# Altium schematic sheet SH2 - 24V BUCK-BOOST CONVERTER.SchDoc: 24V Buck-Boost Converter
size B; CheckedBy: Lance Bantoto; Engineer: Cindy Li; Organization: UW Robotics; Address1: 200 University Avenue; Address2: Waterloo; Address3: Ontario; Address4: Canada N2L 3G6; DocumentNumber: 2; Revision: 2; SheetNumber: 2; SheetTotal: 10
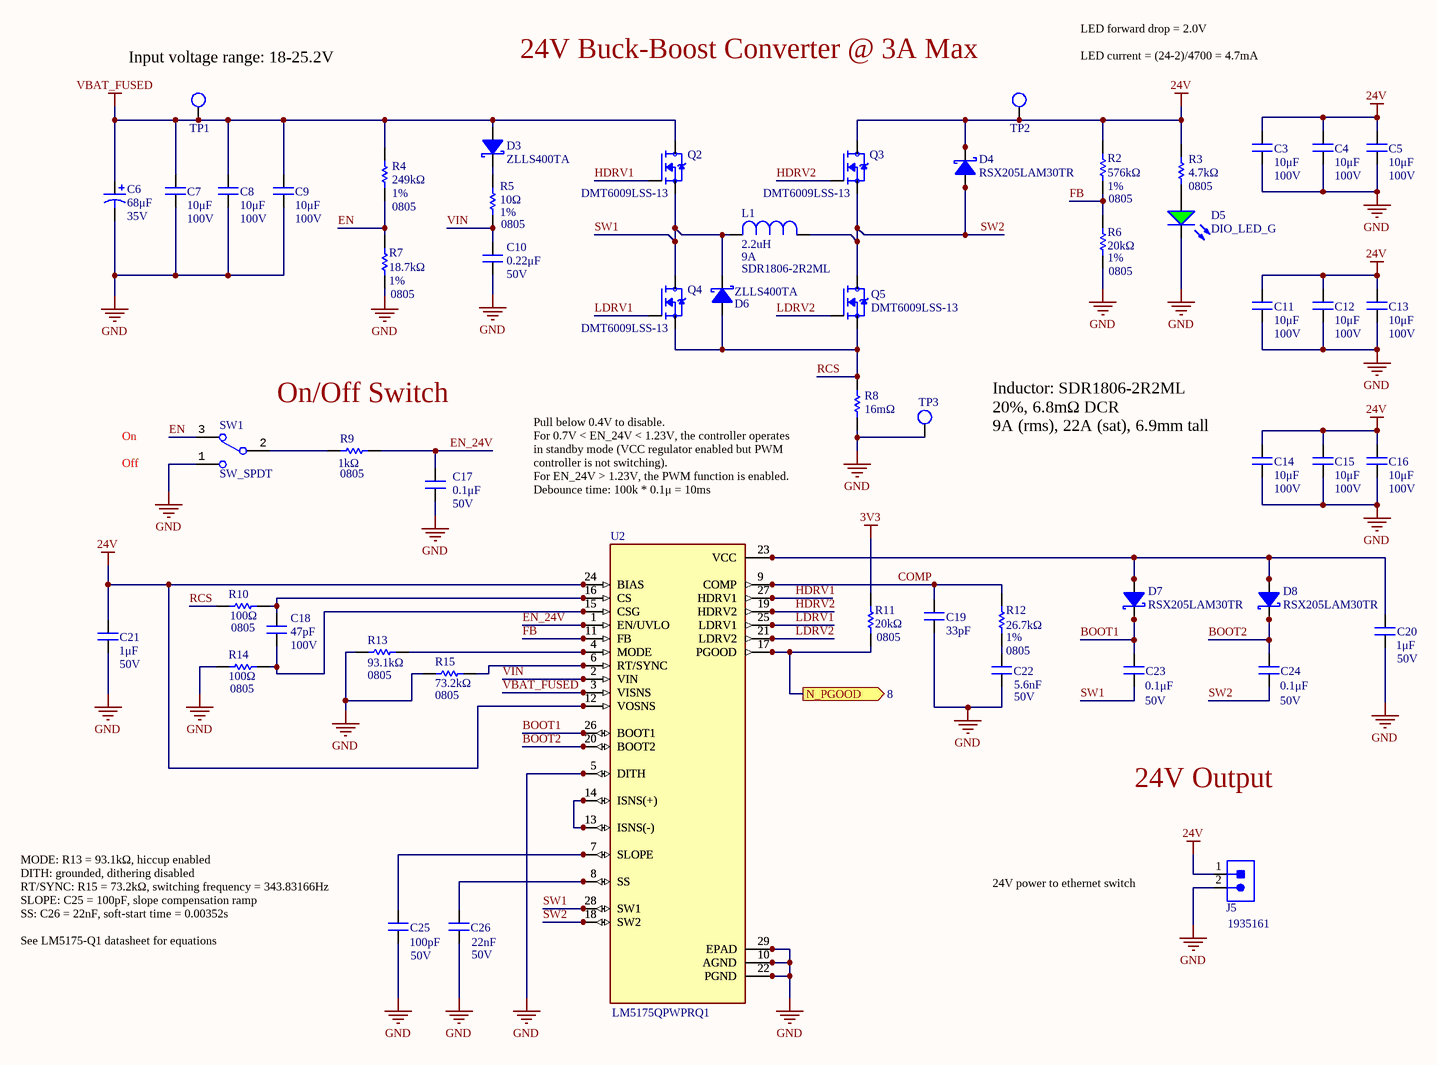
[diagram p0: SH2 - 24V BUCK-BOOST CONVERTER.SchDoc]

## Parts
C3  value 10μF  Voltage Rating: 100V  [CAP1210]  (hidden comment: CAP_10uF_100V_1210)
C4  value 10μF  Voltage Rating: 100V  [CAP1210]  (hidden comment: CAP_10uF_100V_1210)
C5  value 10μF  Voltage Rating: 100V  [CAP1210]  (hidden comment: CAP_10uF_100V_1210)
C6  value 68μF  Voltage Rating: 35V  [RADIAL_NICHION_1V]  (hidden comment: CAP_68uF_35V_ALUM)
C7  value 10μF  Voltage Rating: 100V  [CAP1210]  (hidden comment: CAP_10uF_100V_1210)
C8  value 10μF  Voltage Rating: 100V  [CAP1210]  (hidden comment: CAP_10uF_100V_1210)
C9  value 10μF  Voltage Rating: 100V  [CAP1210]  (hidden comment: CAP_10uF_100V_1210)
C10  value 0.22μF  Voltage Rating: 50V  [CAP2012]  (hidden comment: CAP_0.22uF_50V_0805)
C11  value 10μF  Voltage Rating: 100V  [CAP1210]  (hidden comment: CAP_10uF_100V_1210)
C12  value 10μF  Voltage Rating: 100V  [CAP1210]  (hidden comment: CAP_10uF_100V_1210)
C13  value 10μF  Voltage Rating: 100V  [CAP1210]  (hidden comment: CAP_10uF_100V_1210)
C14  value 10μF  Voltage Rating: 100V  [CAP1210]  (hidden comment: CAP_10uF_100V_1210)
C15  value 10μF  Voltage Rating: 100V  [CAP1210]  (hidden comment: CAP_10uF_100V_1210)
C16  value 10μF  Voltage Rating: 100V  [CAP1210]  (hidden comment: CAP_10uF_100V_1210)
C17  value 0.1μF  Voltage Rating: 50V  [CAP2012]  (hidden comment: CAP_0.1uF_50V_0805)
C18  Voltage Rating: 100V  Capacitance: 47pF  [CAP2012]  (hidden comment: CAP_47pF_100V_0805)
C19  value 33pF  [CAP2012]  (hidden comment: CAP_33pF_50V_0805)
C20  value 1μF  Voltage Rating: 50V  [CAP2012]  (hidden comment: CAP_1uF_50V_0805)
C21  value 1μF  Voltage Rating: 50V  [CAP2012]  (hidden comment: CAP_1uF_50V_0805)
C22  Capacitance: 5.6nF  Voltage Rating: 50V  [CAP2012]  (hidden comment: CAP_5600pF_50V_0805)
C23  value 0.1μF  Voltage Rating: 50V  [CAP2012]  (hidden comment: CAP_0.1uF_50V_0805)
C24  value 0.1μF  Voltage Rating: 50V  [CAP2012]  (hidden comment: CAP_0.1uF_50V_0805)
C25  value 100pF  Voltage Rating: 50V  [CAP2012]  (hidden comment: CAP_100pF_50V_0805)
C26  value 22nF  Voltage Rating: 50V  [CAP2012]  (hidden comment: CAP_0.022uF_50V_0805)
D3  Manufacturer Part Number 1: ZLLS400TA  [SOD-323]  (hidden comment: DIO_SCHOTTKY_40V_520mA)
D4  Manufacturer Part Number 1: RSX205LAM30TR  [SOD-128]  (hidden comment: DIO_SCHOTTKY_30V_2A)
D5  DIO_LED_G  [LED_0805_GREEN]
D6  Manufacturer Part Number 1: ZLLS400TA  [SOD-323]  (hidden comment: DIO_SCHOTTKY_40V_520mA)
D7  Manufacturer Part Number 1: RSX205LAM30TR  [SOD-128]  (hidden comment: DIO_SCHOTTKY_30V_2A)
D8  Manufacturer Part Number 1: RSX205LAM30TR  [SOD-128]  (hidden comment: DIO_SCHOTTKY_30V_2A)
J5  CON_2M_TERM  [1935161]  (value not drawn)
L1  Current Rating: 9A  Manufacturer Part Number 1: SDR1806-2R2ML  Inductance: 2.2uH  [IND_BOURNS_SDR1806]  (hidden comment: IND_2.2uH_9A)
Q2  Manufacturer Part Number 1: DMT6009LSS-13  [TRANS_DMP2002UPS-13]  (hidden comment: NMOS_60V_10.8A)
Q3  Manufacturer Part Number 1: DMT6009LSS-13  [TRANS_DMP2002UPS-13]  (hidden comment: NMOS_60V_10.8A)
Q4  Manufacturer Part Number 1: DMT6009LSS-13  [TRANS_DMP2002UPS-13]  (hidden comment: NMOS_60V_10.8A)
Q5  Manufacturer Part Number 1: DMT6009LSS-13  [TRANS_DMP2002UPS-13]  (hidden comment: NMOS_60V_10.8A)
R2  value 576kΩ  Tolerance: 1%  Package/Footprint: 0805  [RESC0805]  (hidden comment: RES_576kΩ_0805_1%)
R3  value 4.7kΩ  Package/Footprint: 0805  [RESC0805]  (hidden comment: RES_4.7kΩ_0805_5%)
R4  value 249kΩ  Tolerance: 1%  Package/Footprint: 0805  [RESC0805]  (hidden comment: RES_249kΩ_0805_1%)
R5  value 10Ω  Tolerance: 1%  Package/Footprint: 0805  [RESC0805]  (hidden comment: RES_10Ω_0805_1%)
R6  value 20kΩ  Tolerance: 1%  Package/Footprint: 0805  [RESC0805]  (hidden comment: RES_20kΩ_0805_1%)
R7  value 18.7kΩ  Tolerance: 1%  Package/Footprint: 0805  [RESC0805]  (hidden comment: RES_18.7kΩ_0805_1%)
R8  value 16mΩ  [RESC1632X60N]  (hidden comment: RES_16mΩ_1206_1%)
R9  Resistance: 1kΩ  Package/Footprint: 0805  [RESC0805]  (hidden comment: RES_1kΩ_0805_1%)
R10  value 100Ω  Package/Footprint: 0805  [RESC0805]  (hidden comment: RES_100Ω_0805_1%)
R11  value 20kΩ  Package/Footprint: 0805  [RESC0805]  (hidden comment: RES_20kΩ_0805_1%)
R12  value 26.7kΩ  Tolerance: 1%  Package/Footprint: 0805  [RESC0805]  (hidden comment: RES_26.7kΩ_0805_1%)
R13  value 93.1kΩ  Package/Footprint: 0805  [RESC0805]  (hidden comment: RES_93.1kΩ_0805_1%)
R14  value 100Ω  Package/Footprint: 0805  [RESC0805]  (hidden comment: RES_100Ω_0805_1%)
R15  value 73.2kΩ  Package/Footprint: 0805  [RESC0805]  (hidden comment: RES_73.2kΩ_0805_1%)
SW1  SW_SPDT  [100SP1T1B4M2QE]
TP1  TESTPOINT_LOOP  [TESTPOINT_LOOP]  (value not drawn)
TP2  TESTPOINT_LOOP  [TESTPOINT_LOOP]  (value not drawn)
TP3  TESTPOINT_LOOP  [TESTPOINT_LOOP]  (value not drawn)
U2  Manufacturer Part Number 1: LM5175QPWPRQ1  [IC_TPS61196PWPRQ1]  (hidden comment: LM5175PWPR)

## Ports
N_PGOOD (out, see 8)

## Nets
3V3: R11.2
24V: C3.1 C4.1 C5.2 C11.1 C12.1 C13.2 C14.1 C15.1 C16.2 C21.2 D4.2(Cathode) J5.1 Q3.1(D) R2.2 R3.2 TP2.1 U2.12(VOSNS) U2.24(BIAS)
GND: C3.2 C4.2 C5.1 C6.2 C7.1 C8.1 C9.1 C10.1 C11.2 C12.2 C13.1 C14.2 C15.2 C16.1 C17.1 C19.1 C20.1 C21.1 C22.1 C25.1 C26.1 D5.2(K) J5.2 R6.1 R7.1 R8.1 R13.1 R14.1 R15.1 SW1.1 TP3.1 U2.5(DITH) U2.10(AGND) U2.22(PGND) U2.29(EPAD)
VBAT_FUSED: C6.1 C7.2 C8.2 C9.2 D3.1(Anode) Q2.1(D) R4.2 TP1.1 U2.3(VISNS)
BOOT1: C23.2 D7.2(Cathode) U2.26(BOOT1)
BOOT2: C24.2 D8.2(Cathode) U2.20(BOOT2)
COMP: C19.2 R12.2 U2.9(COMP)
EN: R4.1 R7.2 SW1.3
EN_24V: C17.2 R9.2 U2.1(EN/UVLO)
FB: R2.1 R6.2 U2.11(FB)
HDRV1: Q2.3(G) U2.27(HDRV1)
HDRV2: Q3.3(G) U2.19(HDRV2)
LDRV1: Q4.3(G) U2.25(LDRV1)
LDRV2: Q5.3(G) U2.21(LDRV2)
N_PGOOD: R11.1 U2.17(PGOOD) ; port N_PGOOD
RCS: D6.1(Anode) Q4.2(S) Q5.2(S) R8.2 R10.1
SW1: C23.1 D6.2(Cathode) L1.2 Q2.2(S) Q4.1(D) U2.28(SW1)
SW2: C24.1 D4.1(Anode) L1.1 Q3.2(S) Q5.1(D) U2.18(SW2)
VIN: C10.2 R5.1 U2.2(VIN)
NetC18_1: C18.1 R10.2 U2.16(CS)
NetC18_2: C18.2 R14.2 U2.15(CSG)
NetC20_2: C20.2 D7.1(Anode) D8.1(Anode) U2.23(VCC)
NetC22_2: C22.2 R12.1
NetC25_2: C25.2 U2.7(SLOPE)
NetC26_2: C26.2 U2.8(SS)
NetD3_2: D3.2(Cathode) R5.2
NetD5_1: D5.1(A) R3.1
NetR9_1: R9.1 SW1.2
NetR13_2: R13.2 U2.4(MODE)
NetR15_2: R15.2 U2.6(RT/SYNC)
NetU2_13: U2.13(ISNS(-)) U2.14(ISNS(+))

## Notes on the sheet
- (near TP1) Input voltage range: 18-25.2V
- (near TP2) 24V Buck-Boost Converter @ 3A Max
- LED forward drop = 2.0V
  LED current = (24-2)/4700 = 4.7mA
- On
- On/Off Switch
- (near C14) Inductor: SDR1806-2R2ML
  20%, 6.8mΩ DCR
  9A (rms), 22A (sat), 6.9mm tall
- Off
- Pull below 0.4V to disable.
  For 0.7V < EN_24V < 1.23V, the controller operates in standby mode (VCC regulator enabled but PWM controller is not switching).
  For EN_24V > 1.23V, the PWM function is enabled.
  Debounce time: 100k * 0.1μ = 10ms
- 24V Output
- 24V power to ethernet switch
- (near C25) MODE: R13 = 93.1kΩ, hiccup enabled
  DITH: grounded, dithering disabled
  RT/SYNC: R15 = 73.2kΩ, switching frequency = 343.83166Hz
  SLOPE: C25 = 100pF, slope compensation ramp
  SS: C26 = 22nF, soft-start time = 0.00352s
  See LM5175-Q1 datasheet for equations
- Title:
- Project:
- Date:
- Rev:
- Reviewer:
- Engineer:
- Sheet:
- of

## Library data of the parts
C3-C5 C7-C9 C11-C16 = CAP_10uF_100V_1210: CAP CER 10uF 100V X7S 10% 1210; Manufacturer 1: Murata; Manufacturer Part Number 1: GRM32EC72A106KE05L; Package/Footprint: 1210; Tolerance: 10%; Dielectric: X7S; Supplier 1: Digi-Key; Supplier Part Number 1: 490-16266-1-ND; Mounting Type: SMD
C6 = CAP_68uF_35V_ALUM: CAP ALUM 68UF 20% 35V SMD; Manufacturer 1: Nichicon; Manufacturer Part Number 1: UUD1V680MCL1GS; ESR (Equivalent Series Resistance): 340mR; Polarity: Polar; Voltage Rating (DC): 50V; Supplier 1: Digi-Key; Min Operating Temperature: -55°C; Max Operating Temperature: 105°C; Tolerance: 20%; Diameter: 6.3mm; Height - Seated (Max): 7.7mm; Supplier Part Number 1: 493-2289-1-ND; Mounting Type: SMD; Package/Footprint: SMD
C10 = CAP_0.22uF_50V_0805: CAP CER 0.22UF 50V X7R 0805; Manufacturer Part Number 1: C0805C224K5RACTU; Manufacturer 1: KEMET; Package/Footprint: 0805; Supplier Part Number 1: 399-3491-1-ND; Supplier 1: Digi-Key; Dielectric: X7R; LCSC Part #: C5378; Mounting Type: SMD
C17 = CAP_0.1uF_50V_0805: CAP CER 0.1UF 50V X7R 0805; Manufacturer Part Number 1: GCM21BR71H104KA37K; Manufacturer 1: Murata Electronics; Tolerance: 10%; Package/Footprint: 0805; Supplier Part Number 1: 490-8049-1-ND; Supplier 1: Digi-Key; Mount: Surface Mount; Dielectric: X7R; Length: 2mm; Height: 1.25mm; Width: 0.049inch; Thickness: 0.049inch; Depth: 1.25mm; Ratings: AEC-Q200; LCSC Part #: C49678; Mounting Type: SMD
C18 = CAP_47pF_100V_0805: CAP CER 47PF 100V NPO 0805; Manufacturer Part Number 1: AC0805JRNPO0BN470; Manufacturer 1: Yageo; Package/Footprint: 0805; Supplier Part Number 1: 311-3131-1-ND; Supplier 1: Digi-Key; Mounting Type: SMD
C19 = CAP_33pF_50V_0805: CAP CER 33PF 50V C0G/NP0 0805; Manufacturer 1: Samsung Electro-Mechanics; Manufacturer Part Number 1: CL21C330JBANNNC; Package/Footprint: 0805; Mount: Surface Mount; Dielectric: C0G/NP0; Supplier 1: Digi-Key; Supplier Part Number 1: 1276-1105-1-ND; Mounting Type: SMD
C20 C21 = CAP_1uF_50V_0805: CAP CER 1UF 50V X7R 0805; Manufacturer Part Number 1: CL21B105KBFNNNG; Manufacturer 1: Samsung Electro-Mechanics; Tolerane: ±10%; Package/Footprint: 0805; Temperature Coefficient: X7R; Supplier Part Number 1: 1276-6470-1-ND; Supplier 1: Digi-Key; LCSC Part #: C28323; Mounting Type: SMD
C22 = CAP_5600pF_50V_0805: CAP CER 5600PF 50V C0G 0805; Manufacturer 1: TDK Corporation; Manufacturer Part Number 1: CGA4C2C0G1H562J060AA; Tolerance: 5%; Package/Footprint: 0805; Voltage Rating (DC): 50V; Supplier 1: Digi-Key; Supplier Part Number 1: 445-6944-1-ND; Dielectric: C0G; Mounting Type: SMD
C23 C24 = CAP_0.1uF_50V_0805: CAP CER 0.1UF 50V X7R 0805; Manufacturer 1: Murata Electronics; Manufacturer Part Number 1: GCM21BR71H104KA37K; Tolerance: 10%; Package/Footprint: 0805; Mount: Surface Mount; Length: 2mm; Height: 1.25mm; Width: 0.049inch; Thickness: 0.049inch; Depth: 1.25mm; Ratings: AEC-Q200; Supplier 1: Digi-Key; Supplier Part Number 1: 490-8049-1-ND; Dielectric: X7R; LCSC Part #: C49678; Mounting Type: SMD
C25 = CAP_100pF_50V_0805: CAP CER 100PF 50V C0G/NP0 0805; Manufacturer Part Number 1: C0805C101J5GACTU; Manufacturer 1: KEMET; Dielectric: C0G, NP0; Package/Footprint: 0805; Supplier Part Number 1: 399-1122-1-ND; Supplier 1: Digi-Key; Mounting Type: SMD
C26 = CAP_0.022uF_50V_0805: CAP CER 0.022UF 50V C0G 0805; Manufacturer 1: TDK Corporation; Manufacturer Part Number 1: CGA4J2C0G1H223J125AA; Package/Footprint: 2012; Supplier 1: Digi-Key; Supplier Part Number 1: 445-6949-1-ND; Dielectric: C0G; LCSC Part #: C1729; Mounting Type: SMD
D3 D6 = DIO_SCHOTTKY_40V_520mA: DIODE SCHOTTKY 40V 520MA SOD323; Manufacturer 1: Diodes Incorporated; Supplier 1: Digi-Key; Supplier Part Number 1: ZLLS400TACT-ND; Vr (Max): 40V; Io: 520mA; Mounting Type: SMD; Package/Footprint: SOD-323
D4 D7 D8 = DIO_SCHOTTKY_30V_2A: DIODE SCHOTTKY 30V 2A PMDTM; Manufacturer 1: Rohm Semiconductor; Vf (Max): 490mV; Supplier 1: Digi-Key; Supplier Part Number 1: RSX205LAM30CT-ND; Vr (Max): 30V; Io: 2A; Mounting Type: SMD; Package/Footprint: SOD-128
D5 = DIO_LED_G: LED GREEN DIFFUSED 0805 SMD; Manufacturer Part Number 1: LG R971-KN-1; Manufacturer 1: OSRAM; Forward Voltage Drop: 2.2V; Package/Footprint: 0805; Supplier Part Number 1: 475-1410-1-ND; Supplier 1: Digi-Key; Mounting Type: SMD
J5 = CON_2M_TERM: TERM BLK 2POS SIDE ENTRY 5MM; Manufacturer 1: Phoenix Contact; Max Current Rating: 16A; Current: 18A; Voltage: 300V; Package/Footprint: SMD; Supplier 1: Digi-Key; Supplier Part Number 1: 277-1667-ND; Manufacturer Part Number 1: 1935161; Mounting Type: TH
L1 = IND_2.2uH_9A: FIXED IND 2.2UH 9A 6.8 MOHM SMD; Manufacturer 1: Bourns; Core Material: Ferrite; Tolerance: 20%; Supplier 1: Digi-Key; Category: Fixed Inductors; Number of Pins: 2; Min Operating Temperature: -40°C; Max Operating Temperature: 125°C; DC Resistance (DCR): 6.8mOhm; Termination: SMD/SMT; Composition: Wirewound; Height - Seated (Max): 0.272"" (6.90mm); Supplier Part Number 1: SDR1806-2R2MLCT-ND; Size / Dimension: 0.720"" L x 0.551"" W (18.30mm x 14.00mm); Mounting Type: SMD; Package/Footprint: SMD
Q2-Q5 = NMOS_60V_10.8A: MOSFET BVDSS: 41V 60V,SO-8,T&R,2; Manufacturer 1: Texas Instruments; Continuous Drain Current (Id) @ 25°C: 10.8A (Ta); Drive Voltage (Max Rds On, Min Rds On): 4.5V, 10V; Rds On (Max) @ Id, Vgs: 59mOhm @ 5A, 10V; Vgs(th) (Max) @ Id: 9.5mOhm @ 13.5A, 10V; Vgs (Max): ±20V; Power Dissipation (Max): 1.25W (Ta); Package/Footprint: 8-SOIC; Supplier 1: Digi-Key; Supplier Part Number 1: DMT6009LSS-13DICT-ND; Operating Temperature: -55°C - 150°C (TJ); Mounting Type: SMD; Drain to Source Voltage (Vdss): 60V; LCSC Part #: C508211
R2 = RES_576kΩ_0805_1%: RES 576K OHM 1% 1/8W 0805; Manufacturer 1: Panasonic Electronic Components; Manufacturer Part Number 1: ERJ-6ENF5763V; Supplier Part Number 1: P576KCCT-ND; Supplier 1: Digi-Key; LCSC Part #: C17760; Mounting Type: SMD
R3 = RES_4.7kΩ_0805_5%: RES 4.7K OHM 5% 1/8W 0805; Manufacturer 1: Yageo; Manufacturer Part Number 1: RC0805JR-074K7L; Supplier 1: Digi-Key; Supplier Part Number 1: 311-4.7KARCT-ND; LCSC Part #: C17673; Mounting Type: SMD
R4 = RES_249kΩ_0805_1%: RES 249K OHM 1% 1/8W 0805; Manufacturer 1: Yageo; Manufacturer Part Number 1: RC0805FR-07249KL; Supplier Part Number 1: 311-249KCRCT-ND; Supplier 1: Digi-Key; LCSC Part #: C25825; Mounting Type: SMD
R5 = RES_10Ω_0805_1%: RES 10 OHM 1% 1/8W 0805; Manufacturer 1: Yageo; Manufacturer Part Number 1: RC0805FR-0710RL; Supplier Part Number 1: 311-10.0CRCT-ND; Supplier 1: Digi-Key; LCSC Part #: C17415; Mounting Type: SMD
R6 R11 = RES_20kΩ_0805_1%: RES 20K OHM 1% 1/8W 0805; Manufacturer 1: Yageo; Manufacturer Part Number 1: RC0805FR-0720KL; Supplier Part Number 1: 311-20.0KCRCT-ND; Supplier 1: Digi-Key; LCSC Part #: C4328; Mounting Type: SMD
  R11: Tolerance: 1%
R7 = RES_18.7kΩ_0805_1%: RES 18.7K OHM 1% 1/8W 0805 /; Manufacturer 1: Yageo; Manufacturer Part Number 1: RC0805FR-0718K7L; Supplier Part Number 1: 311-18.7KCRCT-ND; Supplier 1: Digi-Key; LCSC Part #: C17499; Mounting Type: SMD
R8 = RES_16mΩ_1206_1%: RES 0.016 OHM 1W 1206 WIDE; Manufacturer 1: Susumu; Manufacturer Part Number 1: PRL1632-R016-F-T1; Tolerance: 1%; Package/Footprint: 1206; Supplier Part Number 1: PRL1632.016FCT-ND; Supplier 1: Digi-Key; Mounting Type: SMD
R9 = RES_1kΩ_0805_1%: RES 1K OHM 1% 1/8W 0805; Manufacturer 1: Yageo; Manufacturer Part Number 1: RC0805FR-071KL; Supplier Part Number 1: 311-1.00KCRCT-ND; Supplier 1: Digi-Key; Tolerance: 1%; LCSC Part #: C17513; Mounting Type: SMD
R10 R14 = RES_100Ω_0805_1%: RES 100 OHM 1% 1/8W 0805; Manufacturer 1: Vishay Dale; Manufacturer Part Number 1: CRCW0805100RFKEA; Supplier Part Number 1: 541-100CCT-ND; Supplier 1: Digi-Key; LCSC Part #: C1790; Mounting Type: SMD
R12 = RES_26.7kΩ_0805_1%: RES 26.7K OHM 1% 1/8W 0805; Manufacturer 1: Panasonic Electronic Components; Manufacturer Part Number 1: ERJ-6ENF2672V; Supplier Part Number 1: P26.7KCCT-ND; Supplier 1: Digi-Key; LCSC Part #: C17581; Mounting Type: SMD
R13 = RES_93.1kΩ_0805_1%: RES 93.1K OHM 1% 1/8W 0805; Manufacturer 1: Panasonic Electronic Components; Manufacturer Part Number 1: ERJ-6ENF9312V; Supplier Part Number 1: P93.1KCCT-ND; Supplier 1: Digi-Key; Tolerance: 1%; LCSC Part #: C17869; Mounting Type: SMD
R15 = RES_73.2kΩ_0805_1%: RES 73.2K OHM 1% 1/8W 0805 /; Manufacturer 1: Panasonic Electronic Components; Manufacturer Part Number 1: ERJ-6ENF7322V; Supplier Part Number 1: P73.2KCCT-ND; Supplier 1: Digi-Key; Tolerance: 1%; LCSC Part #: C17814; Mounting Type: SMD
SW1 = SW_SPDT: SWITCH TOGGLE SPDT 5A 120V; Manufacturer 1: E-Switch; Voltage Rating (DC): 28V; Package/Footprint: TH; Supplier 1: Digi-Key; Manufacturer Part Number 1: 100SP1T1B4M2QE; Throw Configuration: SPDT; Supplier Part Number 1: EG2355-ND; Current Rating: 5A; Mounting Type: TH
TP1-TP3 = TESTPOINT_LOOP: PC TEST POINT MINIATURE WHITE; Manufacturer 1: Keystone Electronics; Manufacturer Part Number 1: 5002; Package/Footprint: TH; Supplier 1: Digi-Key; Supplier Part Number 1: 36-5002-ND; Mounting Type: TH
U2 = LM5175PWPR: IC REG CTRLR BUCK-BOOST 28HTSSOP; Manufacturer 1: Texas Instruments; Supply Voltage: 3.5V - 42V; Switching Frequency: 100kHz - 600kHz; Synchronous Rectifier: Yes; Control Features: Enable, Frequency Control, Power Good, Soft Start; Number of Outputs: 1; Package/Footprint: 28-PowerTSSOP; Supplier 1: Digi-Key; Supplier Part Number 1: 296-44175-1-ND; Clock Sync: Yes; Operating Temperature: -40°C - 150°C (TJ); Mounting Type: SMD; LCSC Part #: C113356